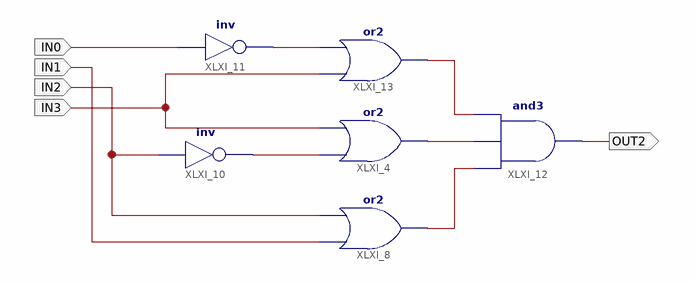
[diagram p0: schematic sheet 1]
// Xilinx ISE schematic Segmento2.sch (spartan3e) as structural Verilog: 6 symbols, 5 ports
module Segmento2 (
  input  IN0,
  input  IN3,
  input  IN2,
  input  IN1,
  output OUT2
);

  wire XLXN_43, XLXN_44, XLXN_45, XLXN_47, XLXN_54;

  or XLXI_4 (XLXN_43, XLXN_54, IN3);
  or XLXI_8 (XLXN_45, IN1, IN2);
  not XLXI_10 (XLXN_54, IN2);
  not XLXI_11 (XLXN_47, IN0);
  and XLXI_12 (OUT2, XLXN_45, XLXN_43, XLXN_44);
  or XLXI_13 (XLXN_44, IN3, XLXN_47);
endmodule
